# EAGLE design USB_Serial_Bridge (EAGLE 9.1.1)

## Sheet 1 of 2
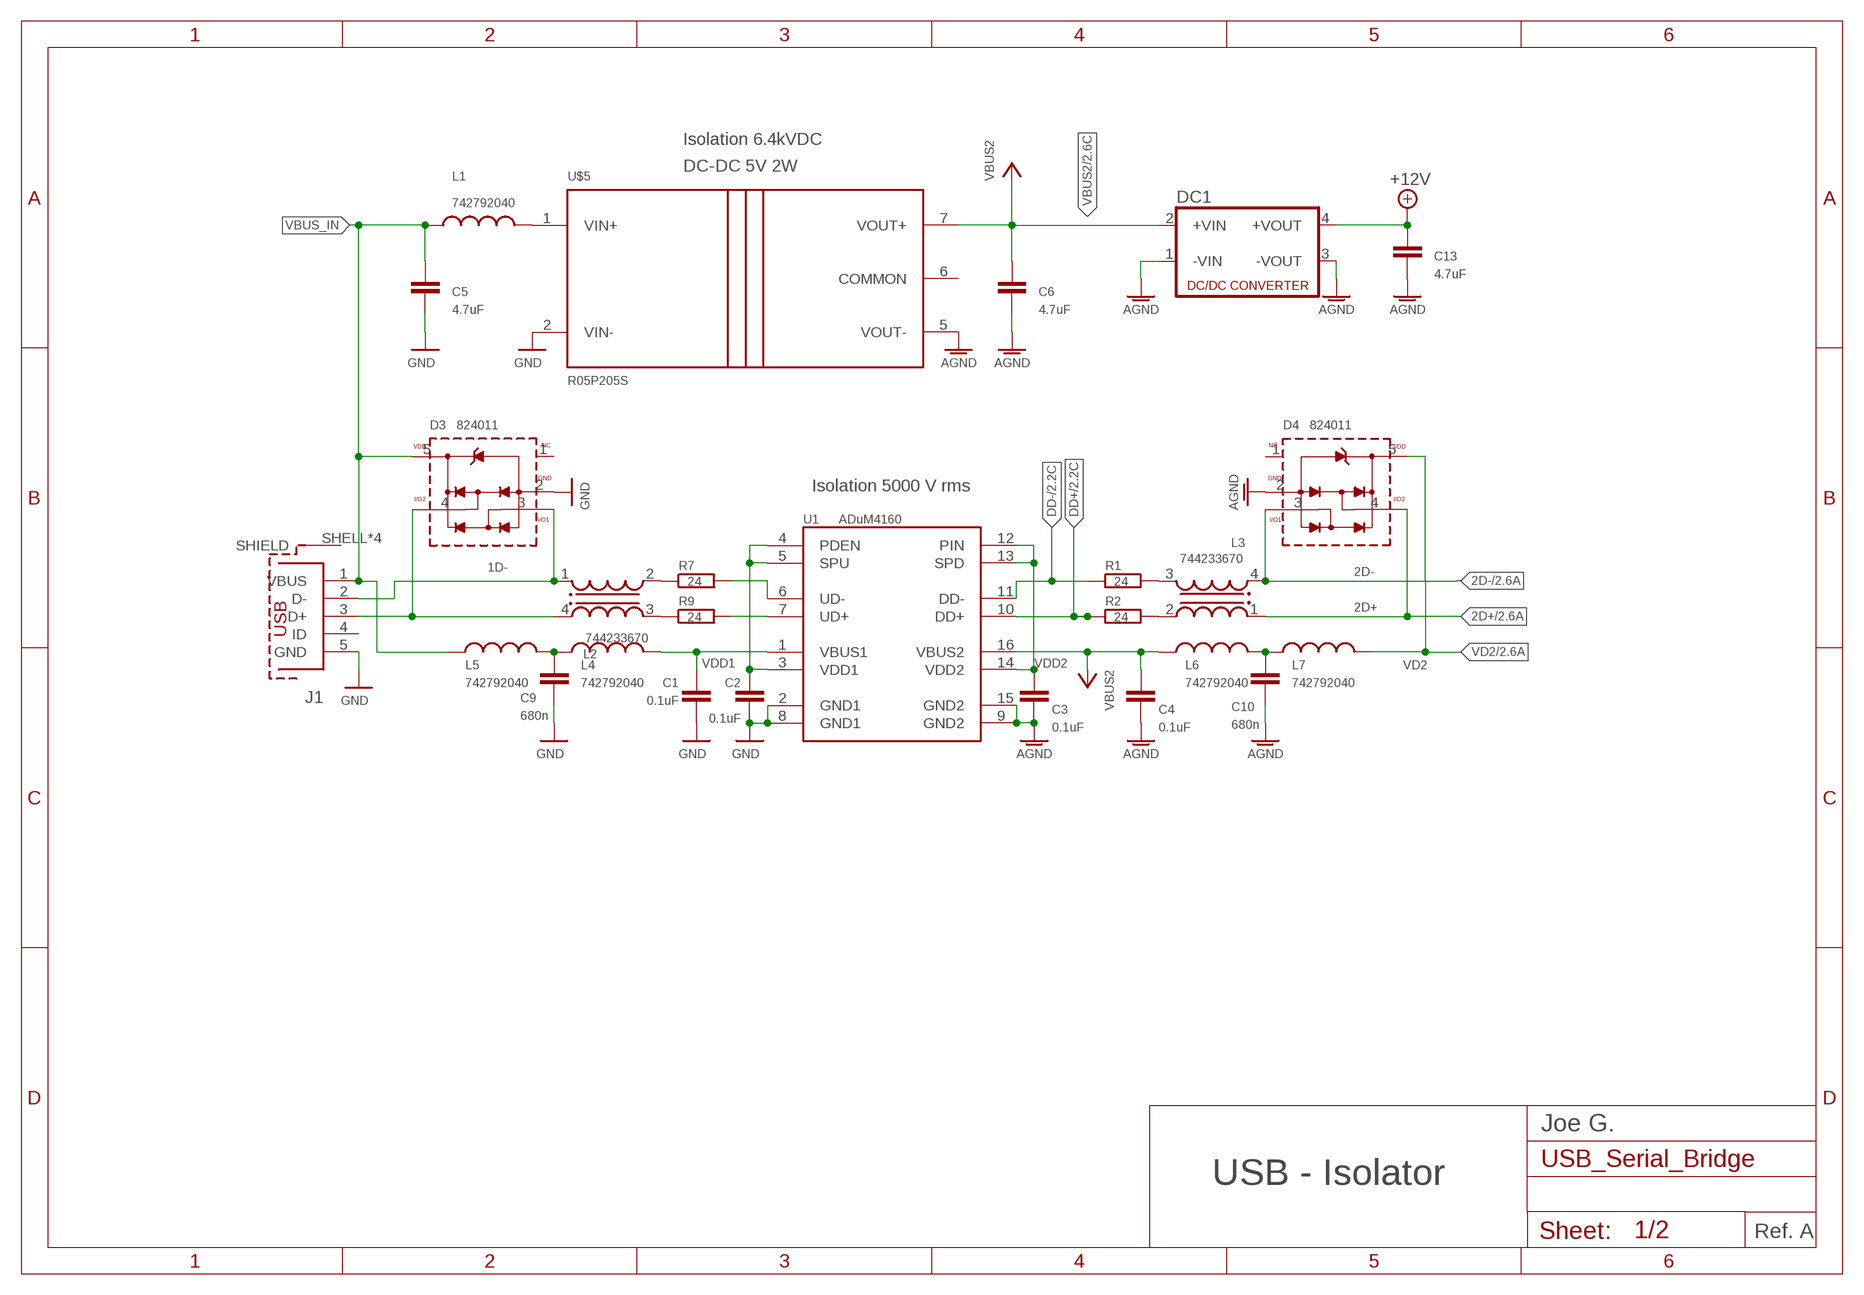
[diagram p0: schematic, sheet 1]

### Parts
C1  0.1uF  CAP0805  [0805]
C2  0.1uF  CAP0805  [0805]
C3  0.1uF  CAP0805  [0805]
C4  0.1uF  CAP0805  [0805]
C5  4.7uF  CAP1206  [1206]
C6  4.7uF  CAP1206  [1206]
C9  680n  C-EUC0805K  [C0805K]
C10  680n  C-EUC0805  [C0805]
C13  4.7uF  CAP1206  [1206]
D3  824011  WE-TVS_824011  [WE-TVS_SOT23-5L]
D4  824011  WE-TVS_824011  [WE-TVS_SOT23-5L]
DC1  DC-DC-CONVERTER_NME  [DC-DC-CONVERTER_NME]
J1  651305142821  [651305142821]
L1  742792040  WE-CBF_0805_74279204_WB_HS  [WE-CBF_0805(W=3.0)]
L2  744233670  WE-CNSW_0805_744231061  [WE-CNSW_0805]
L3  744233670  WE-CNSW_0805_744231061  [WE-CNSW_0805]
L4  742792040  WE-CBF_0805_74279204_WB_HS  [WE-CBF_0805(W=3.0)]
L5  742792040  WE-CBF_0805_74279204_WB_HS  [WE-CBF_0805(W=3.0)]
L6  742792040  WE-CBF_0805_74279204_WB_HS  [WE-CBF_0805(W=3.0)]
L7  742792040  WE-CBF_0805_74279204_WB_HS  [WE-CBF_0805(W=3.0)]
R1  24  R-EU_R0805  [R0805]
R2  24  R-EU_R0805  [R0805]
R7  24  R-EU_R0805  [R0805]
R9  24  R-EU_R0805  [R0805]
U1  ADuM4160  ADUM4160  [SO16W]
U$5  R05P205S  [SIP7_RECON]

### Nets
1D+: D3.4(I/O2) J1.3(D+) L2.4
1D-: D3.3(I/O1) J1.2(D-) L2.1
2D+: D4.4(I/O2) L3.1 ; also sheet 2
2D-: D4.3(I/O1) L3.4 ; also sheet 2
+12V: C13.1 DC1.4(+VOUT) ; also sheet 2
AGND: C3.2 C4.2 C6.2 C10.2 C13.2 D4.2(GND) DC1.1(-VIN) DC1.3(-VOUT) U1.9(GND2) U1.15(GND2) U$5.5(VOUT-) ; also sheet 2
DD+: R2.1 U1.10(DD+) ; also sheet 2
DD-: R1.1 U1.11(DD-) ; also sheet 2
GND: C1.2 C2.2 C5.2 C9.2 D3.2(GND) J1.5(GND) U1.2(GND1) U1.8(GND1) U$5.2(VIN-)
N$2: L2.2 R7.1
N$3: L3.3 R1.2
N$4: L3.2 R2.2
N$5: R9.2 U1.7(UD+)
N$6: L2.3 R9.1
N$7: R7.2 U1.6(UD-)
N$8: C9.1 L4.1 L5.2
N$10: L1.2 U$5.1(VIN+)
N$14: C10.1 L6.2 L7.1
VBUS1: C1.1 L4.2 U1.1(VBUS1)
VBUS2: C4.1 C6.1 DC1.2(+VIN) L6.1 U1.16(VBUS2) U$5.7(VOUT+) ; also sheet 2
VBUS_IN: C5.1 D3.5(VDD) J1.1(VBUS) L1.1 L5.1
VD2: D4.5(VDD) L7.2 ; also sheet 2
VDD1: C2.1 U1.3(VDD1) U1.4(PDEN) U1.5(SPU)
VDD2: C3.1 U1.12(PIN) U1.13(SPD) U1.14(VDD2)
Unconnected: D3.1(NC) D4.1(NC) J1.4(ID) J1.SHELL1(SHIELD) J1.SHELL2(SHIELD) J1.SHELL3(SHIELD) J1.SHELL(SHIELD)

### Notes on the sheet
- Isolation 6.4kVDC
- DC-DC 5V 2W
- Isolation 5000 V rms
- Joe G.
- USB - Isolator
- Ref. A

## Sheet 2 of 2
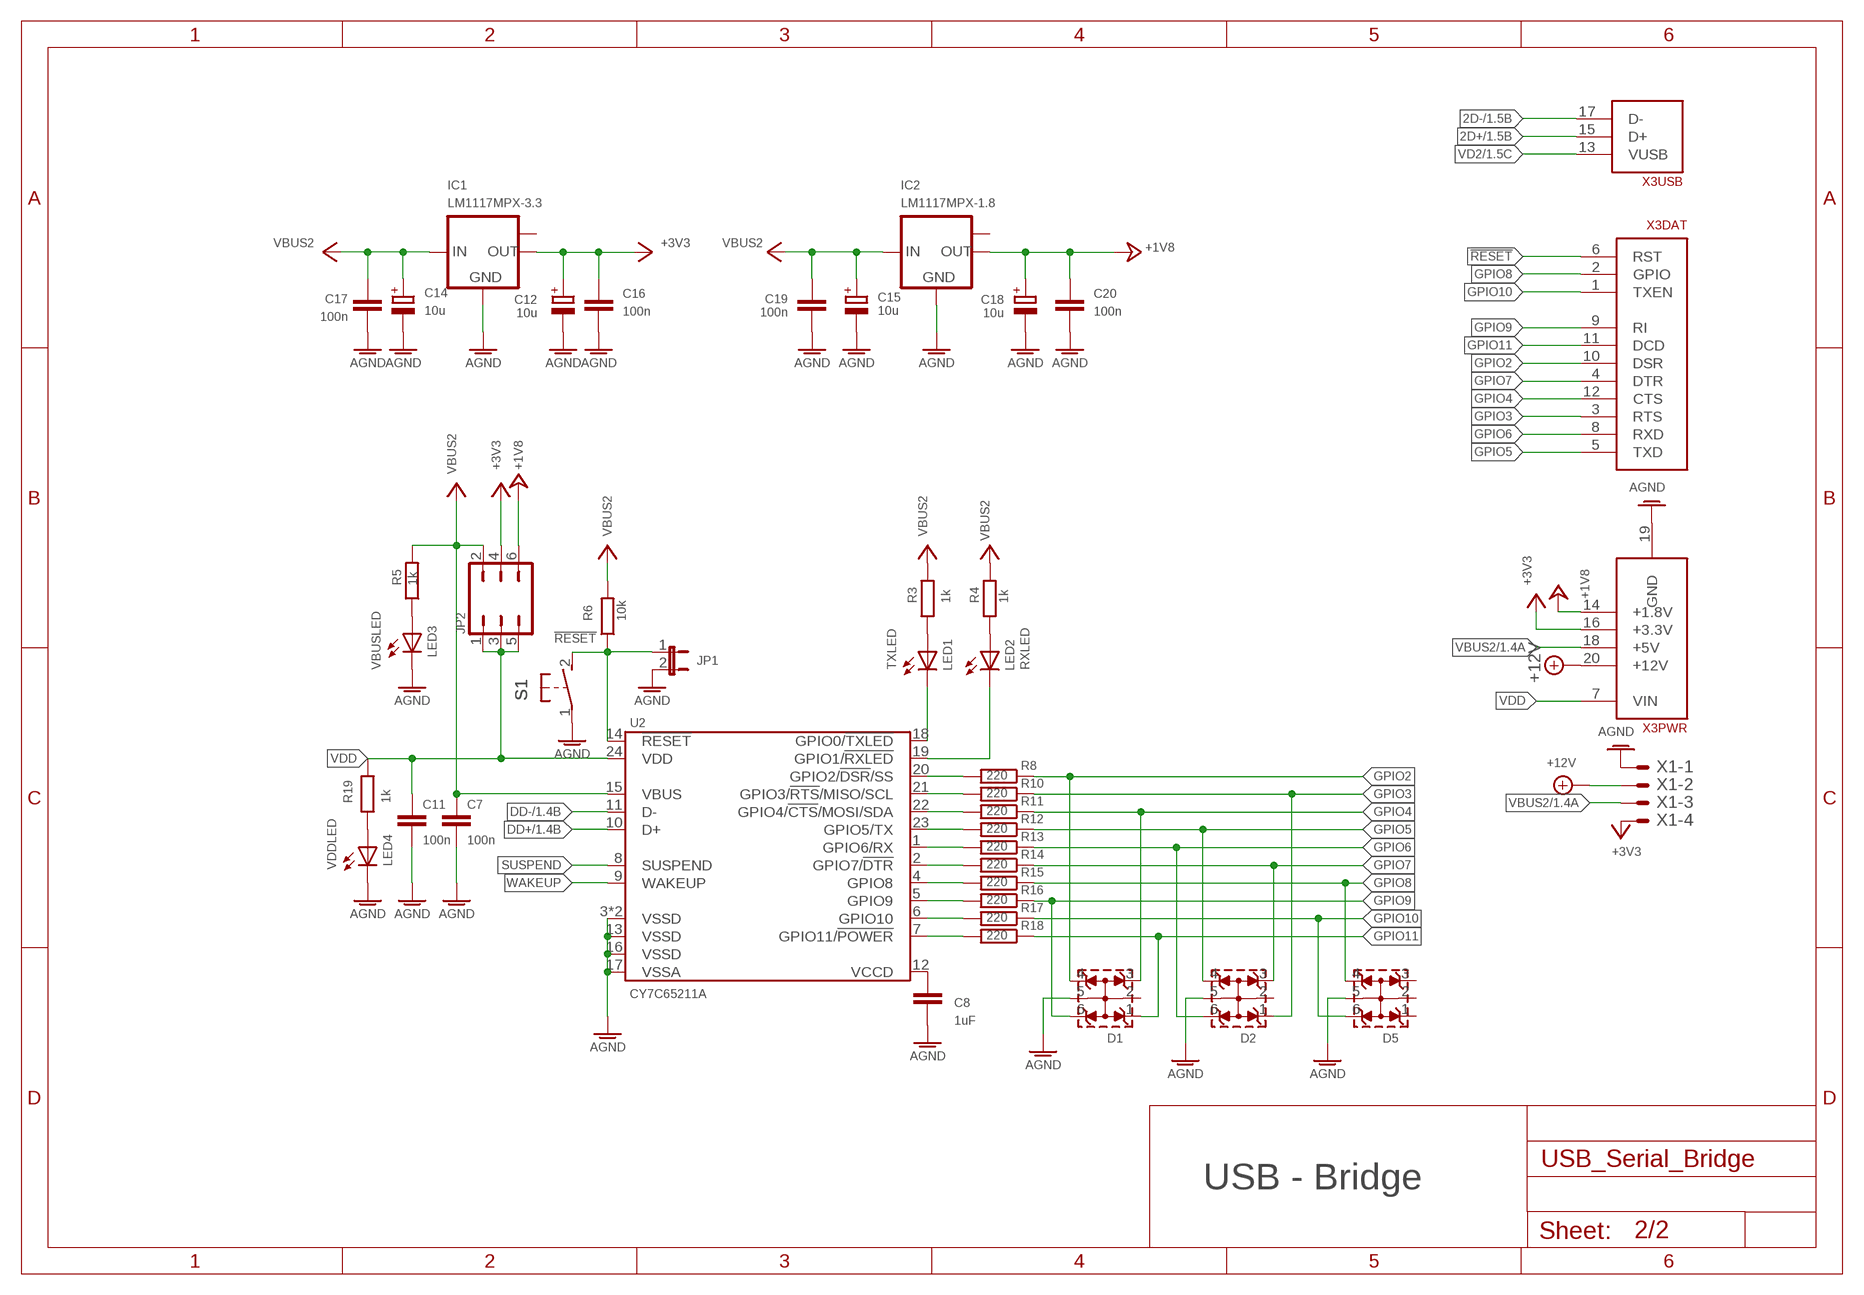
[diagram p1: schematic, sheet 2]

### Parts
C7  100n  C-EUC0805  [C0805]
C8  1uF  CAP1206  [1206]
C11  100n  C-EUC0805  [C0805]
C12  10u  CPOL-EUSMCB  [SMC_B]
C14  10u  CPOL-EUSMCB  [SMC_B]
C15  10u  CPOL-EUSMCB  [SMC_B]
C16  100n  C-EUC0805  [C0805]
C17  100n  C-EUC0805  [C0805]
C18  10u  CPOL-EUSMCB  [SMC_B]
C19  100n  C-EUC0805  [C0805]
C20  100n  C-EUC0805  [C0805]
D1  WE-TVS_82402304  [WE-TVS_SOT23-6L]
D2  WE-TVS_82402304  [WE-TVS_SOT23-6L]
D5  WE-TVS_82402304  [WE-TVS_SOT23-6L]
IC1  LM1117MPX-3.3  LM1117MPX-1.8  [SOT223]
IC2  LM1117MPX-1.8  LM1117MPX-3.3  [SOT223]
JP1  JP1E  [JP1]
JP2  JP3Q  [JP3Q]
LED1  LEDSML0603  [SML0603]
LED2  LEDSML0603  [SML0603]
LED3  LEDSML0603  [SML0603]
LED4  LEDSML0603  [SML0603]
R3  1k  R-EU_M0805  [M0805]
R4  1k  R-EU_M0805  [M0805]
R5  1k  R-EU_M0805  [M0805]
R6  10k  R-EU_M0805  [M0805]
R8  220  R-EU_M0805  [M0805]
R10  220  R-EU_M0805  [M0805]
R11  220  R-EU_M0805  [M0805]
R12  220  R-EU_M0805  [M0805]
R13  220  R-EU_M0805  [M0805]
R14  220  R-EU_M0805  [M0805]
R15  220  R-EU_M0805  [M0805]
R16  220  R-EU_M0805  [M0805]
R17  220  R-EU_M0805  [M0805]
R18  220  R-EU_M0805  [M0805]
R19  1k  R-EU_M0805  [M0805]
S1  SWITCH-OMRON_31-XX  [SWITCH-OMRON_B3F-31XX]
U2  CY7C65211A  CY7C65211  [QFN-24]
X1  AKL18X-04W  [AKL182-04]
X3  ALLSERIALMM  [MAIN-THT]

### Nets
2D+: X3.15(USB:D+) ; also sheet 1
2D-: X3.17(USB:D-) ; also sheet 1
!RESET: JP1.1 R6.1 S1.2(S) U2.14(!RESET) X3.6(DAT:RST)
+1V8: C18.+ C20.1 IC2.2(OUT) JP2.6 X3.14(PWR:+1.8V)
+3V3: C12.+ C16.1 IC1.2(OUT) JP2.4 X1.P$4 X3.16(PWR:+3.3V)
+12V: X1.P$2 X3.20(PWR:+12V) ; also sheet 1
AGND: C7.2 C8.2 C11.2 C12.- C14.- C15.- C16.2 C17.2 C18.- C19.2 C20.2 D1.5(GND) D2.5(GND) D5.5(GND) IC1.1(GND) IC2.1(GND) JP1.2 LED3.C LED4.C S1.1(P) U2.3(VSSD) U2.13(VSSD) U2.16(VSSD) U2.17(VSSA) U2.EP(VSSD) X1.P$1 X3.19(PWR:GND) ; also sheet 1
DD+: U2.10(D+) ; also sheet 1
DD-: U2.11(D-) ; also sheet 1
GPIO2: D1.4 R8.1 X3.10(DAT:DSR)
GPIO3: D2.1 R10.1 X3.3(DAT:RTS)
GPIO4: D1.3 R11.1 X3.12(DAT:CTS)
GPIO5: D2.4 R12.1 X3.5(DAT:TXD)
GPIO6: D2.6 R13.1 X3.8(DAT:RXD)
GPIO7: D2.3 R14.1 X3.4(DAT:DTR)
GPIO8: D5.4 R15.1 X3.2(DAT:GPIO)
GPIO9: D1.6 R16.1 X3.9(DAT:RI)
GPIO10: D5.6 R17.1 X3.1(DAT:TXEN)
GPIO11: D1.1 R18.1 X3.11(DAT:DCD)
N$11: C8.1 U2.12(VCCD)
N$15: LED4.A R19.1
N$18: LED1.A R3.1
N$19: LED2.A R4.1
N$21: LED1.C U2.18(GPIO0/!TXLED)
N$22: LED2.C U2.19(GPIO1/!RXLED)
N$23: R8.2 U2.20(GPIO2/!DSR!/SS)
N$24: R10.2 U2.21(GPIO3/!RTS!/MISO/SCL)
N$25: LED3.A R5.1
N$26: R11.2 U2.22(GPIO4/!CTS!/MOSI/SDA)
N$27: R12.2 U2.23(GPIO5/TX)
N$28: R13.2 U2.1(GPIO6/RX)
N$29: R14.2 U2.2(GPIO7/!DTR)
N$30: R15.2 U2.4(GPIO8)
N$31: R16.2 U2.5(GPIO9)
N$32: R17.2 U2.6(GPIO10)
N$33: R18.2 U2.7(GPIO11/!POWER)
SUSPEND: U2.8(SUSPEND)
VBUS2: C7.1 C14.+ C15.+ C17.1 C19.1 IC1.3(IN) IC2.3(IN) JP2.2 R3.2 R4.2 R5.2 R6.2 U2.15(VBUS) X1.P$3 X3.18(PWR:+5V) ; also sheet 1
VD2: X3.13(USB:VUSB) ; also sheet 1
VDD: C11.1 JP2.1 JP2.3 JP2.5 R19.2 U2.24(VDD) X3.7(PWR:VIN)
WAKEUP: U2.9(WAKEUP)
Unconnected: D1.2(GND) D2.2(GND) D5.1 D5.2(GND) D5.3 IC1.TAB(OUT1) IC2.TAB(OUT1)

### Notes on the sheet
- VBUSLED | TXLED | RXLED
- VDDLED
- USB - Bridge

## Power pins joined to a net without a drawn wire
COMMON: U$5.6(COMMON)

## Library data of the parts
C1-C6 C8 C13 = CH_passive:CAP: Capacitor Standard 0603 ceramic capacitor, and 0.1" leaded capacitor.
C7 C9-C11 C16 C17 C19 C20 = rcl:C-EU: CAPACITOR, European symbol
C12 C14 C15 C18 = rcl:CPOL-EU: POLARIZED CAPACITOR, European symbol
D1 D2 D5 = EMCComponents (rev18c):WE-TVS_82402304: TVS Diode Standard Series Characteristics Operating temperature: –55 ºC to +85 °C for 824 023 x; –55 ºC to +125 °C for 824 021/824 022 Very low clamping voltage High ESD withstand voltage Unidirectional or bidirectional protection RoHS, REACH and free of halogens Applications DC power supply Headsets and accessories PDAs Digital cameras MP3-Player Touch Panels ESD protection in accordance with EN 61000-4-2 – 8 kV contact discharge – 15 kV air discharge Updated by Dan Xu 2014-07-11 2014 (C) Wurth Elektronik
D3 D4 = EMCComponents (rev18c):WE-TVS_824011: TVS Diode High Speed Series Characteristics Low clamping voltage Sturdy design Very low capacitance Flow Thru Design for a simple layout Rail to Rail protection Epoxy flame resistant UL94 V-0 RoHS, REACH and free of halogens Applications Very fast data lines USB 2.0 Ethernet PoE VGA Sim Cards Keypads ESD protection in accordance with EN 61000-4-2, – 8 kV contact discharge – 15 kV air discharge <http://katalog.we-online.de/media/images/v2/Family_WE-TVS_HIGHSPEED.jpg> Details see: http://katalog.we-online.de/en/pbs/WE-TVS_High_Speed/824001? Updated by Dan Xu 2014-07-11 2014 (C) Wurth Elektronik
DC1 = OUT_dc-dc-converter:DC-DC-CONVERTER_NME: DC-DC CONVERTER; MF: C & D TECHNOLOGIES, INC; MPN: NME1205D; OC_FARNELL: 1021466; OC_NEWARK: 98B8198
IC1 IC2 = lm1117:LM1117MPX-*
J1 = InputOutputIO (rev18a):651305142821: WR-COM Horizontal 5 Contacts Mini USB Type AB=>Code : Con_I-O_COM_MiniUSB_651305142821 <http://katalog.we-online.de/media/images/eican/Con_I-O_COM_MiniUSB_651305142821_pf2.jpg> Details see: http://katalog.we-online.de/en/em/COM_SMT_MINI_TYPE_AB_HORIZONTAL/651305142821 Created 2014-07-09, Karrer Zheng 2014 (C) Würth Elektronik
JP1 = jumper:JP1E: JUMPER
JP2 = jumper:JP3Q: JUMPER
L1 L4-L7 = EMCComponents (rev18c):WE-CBF_0805: WE-CBF SMD EMI Suppression Ferrite Bead Characteristics Reliable Ni-Sn electrodes High rated current up to 6 A Operating temperature: –55 ºC to +125 ºC Applications Perfect as data lined filter and for uncoupling of distribution voltage Variant abbreviation WB means WIDE BAND HS means HIGH SPEED HC means HIGH CURRENT <http://katalog.we-online.de/media/images/v2/Family_WE-CBF.jpg> Details see: http://katalog.we-online.de/en/pbs/WE-CBF Updated on 2014-06-19 2014 (C) Wurth Elektronik; WE-NUMBER: 74279204/600Ω(Z@100MHz)
L2 L3 = EMCComponents (rev18c):WE-CNSW_0805: WE-CNSW SMD Common Mode Line Filter Characteristics High common mode noise suppression at high frequencies Small influence on high speed signals through winding symmetry Operating temperature: –40 ºC to +125 ºC (Size 0805/1206/1812); –40 ºC to +105 ºC (Size 0603) Applications USB 2.0 IEEE 1394 (Firewire) LVDS High Speed Data Lines LAN <http://katalog.we-online.de/media/images/v2/we-cnsw_stroko_smd_gruppe.jpg> Details see: http://katalog.we-online.de/en/pbs/WE-CNSW Updated by Dan Xu 2014-06-30 2014 (C) Wurth Elektronik; WE-NUMBER: 744231061/67Ω(Z@100MHz)
LED1-LED4 = led:LED: LED OSRAM: - CHIPLED LG R971, LG N971, LY N971, LG Q971, LY Q971, LO R971, LY R971 LH N974, LH R974 LS Q976, LO Q976, LY Q976 LO Q996 - Hyper CHIPLED LW Q18S LB Q993, LB Q99A, LB R99A - SideLED LS A670, LO A670, LY A670, LG A670, LP A670 LB A673, LV A673, LT A673, LW A673 LH A674 LY A675 LS A676, LA A676, LO A676, LY A676, LW A676 LS A679, LY A679, LG A679 - Hyper Micro SIDELED® LS Y876, LA Y876, LO Y876, LY Y876 LT Y87S - SmartLED LW L88C, LW L88S LB L89C, LB L89S, LG L890 LS L89K, LO L89K, LY L89K LS L896, LA L896, LO L896, LY L896 - TOPLED LS T670, LO T670, LY T670, LG T670, LP T670 LSG T670, LSP T670, LSY T670, LOP T670, LYG T670 LG T671, LOG T671, LSG T671 LB T673, LV T673, LT T673, LW T673 LH T674 LS T676, LA T676, LO T676, LY T676, LB T676, LH T676, LSB T676, LW T676 LB T67C, LV T67C, LT T67C, LS T67K, LO T67K, LY T67K, LW E67C LS E67B, LA E67B, LO E67B, LY E67B, LB E67C, LV E67C, LT E67C LW T67C LS T679, LY T679, LG T679 LS T770, LO T770, LY T770, LG T770, LP T770 LB T773, LV T773, LT T773, LW T773 LH T774 LS E675, LA E675, LY E675, LS T675 LS T776, LA T776, LO T776, LY T776, LB T776 LHGB T686 LT T68C, LB T68C - Hyper Mini TOPLED® LB M676 - Mini TOPLED Santana® LG M470 LS M47K, LO M47K, LY M47K Source: http://www.osram.convergy.de LUXEON: - LUMILED® LXK2-PW12-R00, LXK2-PW12-S00, LXK2-PW14-U00, LXK2-PW14-V00 LXK2-PM12-R00, LXK2-PM12-S00, LXK2-PM14-U00 LXK2-PE12-Q00, LXK2-PE12-R00, LXK2-PE12-S00, LXK2-PE14-T00, LXK2-PE14-U00 LXK2-PB12-K00, LXK2-PB12-L00, LXK2-PB12-M00, LXK2-PB14-N00, LXK2-PB14-P00, LXK2-PB14-Q00 LXK2-PR12-L00, LXK2-PR12-M00, LXK2-PR14-Q00, LXK2-PR14-R00 LXK2-PD12-Q00, LXK2-PD12-R00, LXK2-PD12-S00 LXK2-PH12-R00, LXK2-PH12-S00 LXK2-PL12-P00, LXK2-PL12-Q00, LXK2-PL12-R00 Source: www.luxeon.com KINGBRIGHT: KA-3528ASYC Source: www.kingbright.com
R1-R19 = rcl:R-EU_: RESISTOR, European symbol
S1 = switch_omron_1:SWITCH-OMRON_31-XX: OMRON SWITCH; MPN: B3F-3100; OC_FARNELL: 959704; OC_NEWARK: 36M3582
U1 = CH_Analog_Devices:ADUM4160: Analog Devices Low/Full Speed USB Isolator
U2 = Cypress:CY7C65211
U$5 = traco_tma:R05P205S
X1 = Testcon-riacon_akl:AKL18X-04: Riacon AKL18X Steckverbinder 4-Pol Grid = 3,5mm
X3 = AllSerial:ALLSERIAL

## Board
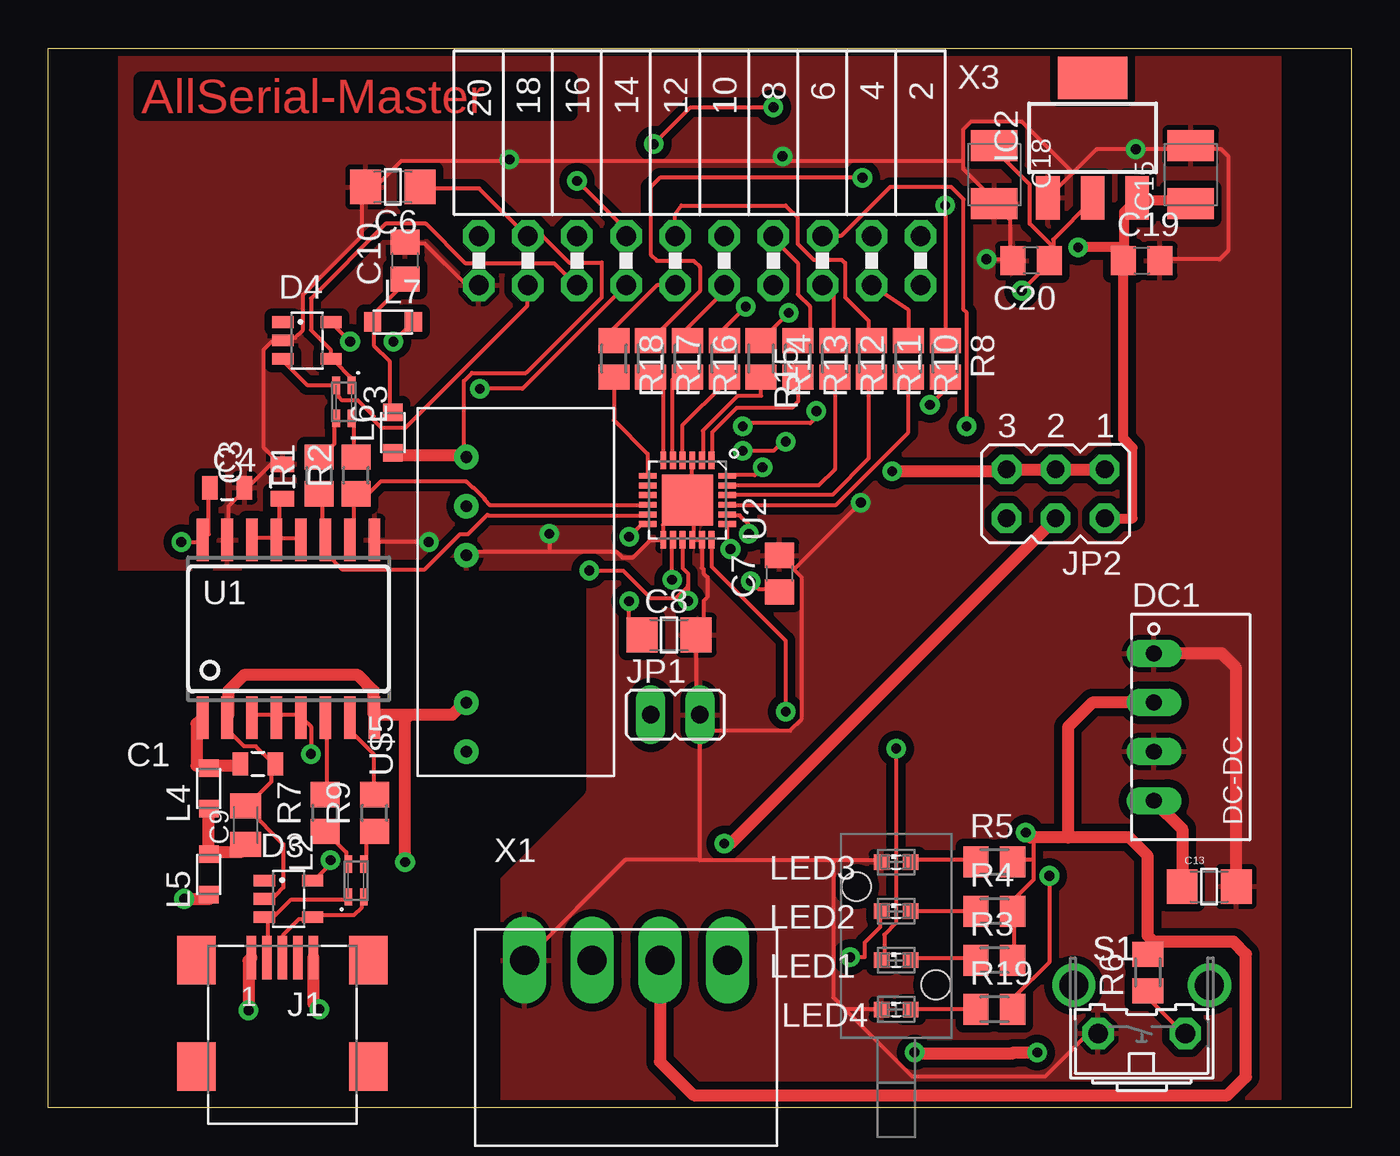
[diagram p2: board, top side]
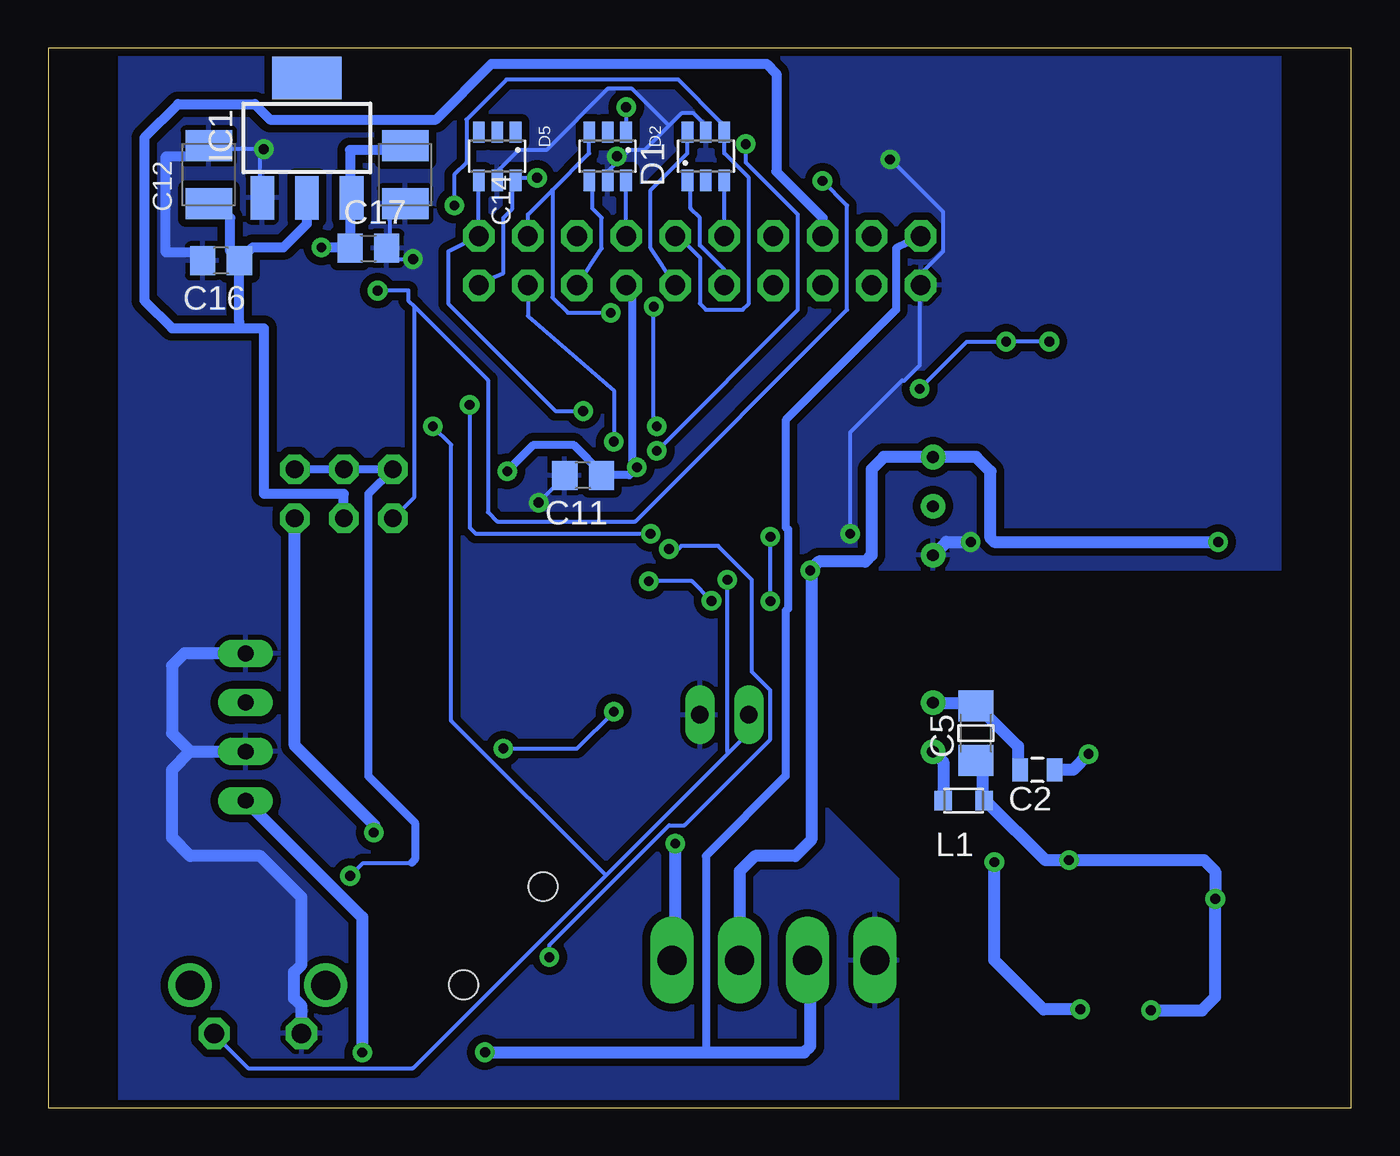
[diagram p3: board, bottom side, seen from below]

Size 67.4 x 54.8 mm. Coordinates in mm from the lower left corner, seen from the top.
Copper layers (1*16): Top 0.035mm / dielectric 1.5mm / Bottom 0.035mm
Design rules "CHome": minimum track width 8mil, minimum drill 20mil, track to track 8mil, track to pad 8mil, pad to pad 8mil, via to via 8mil, smd to smd 8mil, copper to edge 10mil, drill to drill 8mil, minimum pad ring 12mil, minimum via ring 10mil, stop-mask expansion 4mil, vias tented up to drill 25mil, thermal gap 10mil
tRestrict: area 3.2,0 to 27.4,27.3
bRestrict: area 3.2,0 to 27.4,27.3

### Footprints (pad centres in the part's own frame; a part is rotated, then mirrored left to right if it is on the bottom)
0805 = smd 0.8 x 1.2: 1 -0.9,0; 2 0.9,0
1206 = smd 1.6 x 1.8: 1 -1.4,0; 2 1.4,0
C0805 = smd 1.3 x 1.5: 1 -0.95,0; 2 0.95,0
C0805K = smd 1.3 x 1.6: 1 -1,0; 2 1,0
SMC_B = smd 1.6 x 2.4: + -1.5,0; - 1.5,0
WE-TVS_SOT23-6L = smd 1.1 x 0.6: 1 -1.25,0.95; 2 -1.25,0; 3 -1.25,-0.95; 4 1.25,-0.95; 5 1.25,0; 6 1.25,0.95
WE-TVS_SOT23-5L = smd 1.1 x 0.6: 1 -1.25,0.95; 2 -1.25,0; 3 -1.25,-0.95; 4 1.25,-0.95; 5 1.25,0.95
DC-DC-CONVERTER_NME = drill 0.813 long: 1 0,3.81; 2 0,1.27; 3 0,-1.27; 4 0,-3.81
SOT223 = smd 1.219 x 2.235: 1 -2.311,-3.099; 2 0,-3.099; 3 2.311,-3.099 | smd 3.6 x 2.2: TAB 0,3.099
651305142821 = smd 0.5 x 2.25: 1 -1.6,0.125; 2 -0.8,0.125; 3 0,0.125; 4 0.8,0.125; 5 1.6,0.125 | smd 2 x 2.5: SHELL -4.45,0; SHELL1 4.45,0; SHELL2 4.45,-5.5; SHELL3 -4.45,-5.5
JP1 = drill 0.914 long: 1 0,-1.27; 2 0,1.27
JP3Q = drill 0.914 octagon: 1 -2.54,-1.27; 2 -2.54,1.27; 3 0,-1.27; 4 0,1.27; 5 2.54,-1.27; 6 2.54,1.27
WE-CBF_0805(W=3.0) = smd 0.9 x 1: 1 -1.05,0; 2 1.05,0
WE-CNSW_0805 = smd 0.9 x 0.4: 1 -0.85,0.4; 2 0.85,0.4; 3 0.85,-0.4; 4 -0.85,-0.4
SML0603 = smd 0.8 x 0.8: A 0.75,0; C -0.75,0
R0805 = smd 1.3 x 1.5: 1 -0.95,0; 2 0.95,0
M0805 = smd 1.3 x 1.6: 1 -0.95,0; 2 0.95,0
SWITCH-OMRON_B3F-31XX = drill 1.016 octagon: 1 -2.261,-1.245; 2 2.261,-1.245 | drill 1.499 pad 2.159: 3 -3.505,1.245; 4 3.505,1.245
SO16W = smd 0.6 x 2.2: 1 -4.445,-4.6; 2 -3.175,-4.6; 3 -1.905,-4.6; 4 -0.635,-4.6; 5 0.635,-4.6; 6 1.905,-4.6; 7 3.175,-4.6; 8 4.445,-4.6; 9 4.445,4.6; 10 3.175,4.6; 11 1.905,4.6; 12 0.635,4.6; 13 -0.635,4.6; 14 -1.905,4.6; 15 -3.175,4.6; 16 -4.445,4.6
QFN-24 = smd 0.9 x 0.3: 1 -2.05,1.25; 2 -2.05,0.75; 3 -2.05,0.25; 4 -2.05,-0.25; 5 -2.05,-0.75; 6 -2.05,-1.25; 13 2.05,-1.25; 14 2.05,-0.75; 15 2.05,-0.25; 16 2.05,0.25; 17 2.05,0.75; 18 2.05,1.25 | smd 0.3 x 0.9: 7 -1.25,-2.05; 8 -0.75,-2.05; 9 -0.25,-2.05; 10 0.25,-2.05; 11 0.75,-2.05; 12 1.25,-2.05; 19 1.25,2.05; 20 0.75,2.05; 21 0.25,2.05; 22 -0.25,2.05; 23 -0.75,2.05; 24 -1.25,2.05 | smd 2.65 x 2.65: EP 0,0
1296.1004 = hole 1.5: 2.05,-2.54; -2.05,2.54
SIP7_RECON = drill 0.6 pad 1.27: 1 -8.89,3.81; 2 -6.35,3.81; 5 1.27,3.81; 6 3.81,3.81; 7 6.35,3.81
AKL182-04 = drill 1.5 pad 2.184 long: P$1 -5.25,0; P$2 -1.75,0; P$3 1.75,0; P$4 5.25,0
MAIN-THT = drill 1.016 octagon: 1 11.43,42.545; 2 11.43,45.085; 3 8.89,42.545; 4 8.89,45.085; 5 6.35,42.545; 6 6.35,45.085; 7 3.81,42.545; 8 3.81,45.085; 9 1.27,42.545; 10 1.27,45.085; 11 -1.27,42.545; 12 -1.27,45.085; 13 -3.81,42.545; 14 -3.81,45.085; 15 -6.35,42.545; 16 -6.35,45.085; 17 -8.89,42.545; 18 -8.89,45.085; 19 -11.43,42.545; 20 -11.43,45.085

### Placement (x,y rotation side)
C1  10.84,17.78 0 top
C2  16.24,17.46 180 bottom
C3  12.11,32.38 90 top
C4  9.25,32.07 0 top
C5  19.41,19.37 90 bottom
C6  17.83,47.62 180 top
C7  37.83,27.62 90 top
C8  32.11,24.45 0 top
C9  10.21,14.61 90 top
C10  18.46,43.81 90 top
C11  39.73,32.7 180 bottom
C12  59.1,48.26 90 bottom
C13  60.05,11.43 0 top
C14  48.94,48.26 270 bottom
C15  59.1,48.26 90 top
C16  58.47,43.81 180 bottom
C17  50.84,44.45 0 bottom
C18  48.94,48.26 270 top
C19  56.56,43.81 0 top
C20  50.84,43.81 180 top
D1  33.38,49.21 90 bottom
D2  38.46,49.21 270 bottom
D3  12.43,10.79 0 top
D4  13.38,39.69 0 top
D5  44.18,49.21 270 bottom
DC1  57.2,19.68 0 top
IC1  54.02,50.16 0 bottom
IC2  54.02,50.16 0 top
J1  12.11,7.62 0 top
JP1  32.43,20.32 270 top
JP2  52.12,31.75 180 top
L1  20.05,15.88 180 bottom
L2  15.92,11.75 90 top
L3  15.29,36.51 270 top
L4  8.3,16.51 90 top
L5  8.3,12.06 90 top
L6  17.83,34.92 90 top
L7  17.83,40.64 0 top
LED1  43.86,7.62 0 top
LED2  43.86,10.16 0 top
LED3  43.86,12.7 0 top
LED4  43.86,5.08 0 top
R1  14.02,32.7 90 top
R2  15.92,32.7 90 top
R3  48.94,7.62 0 top
R4  48.94,10.16 0 top
R5  48.94,12.7 0 top
R6  56.88,6.99 90 top
R7  14.33,15.24 90 top
R8  46.4,38.73 270 top
R9  16.87,15.24 90 top
R10  44.5,38.73 270 top
R11  42.59,38.73 270 top
R12  40.69,38.73 270 top
R13  38.78,38.73 270 top
R14  36.88,38.73 270 top
R15  34.97,38.73 270 top
R16  33.07,38.73 270 top
R17  31.16,38.73 270 top
R18  29.26,38.73 270 top
R19  48.94,5.08 0 top
S1  56.56,5.08 0 top
U1  12.43,24.77 0 top
U2  33.07,31.43 270 top
U$1  [1296.1004]  43.86,8.89 180 top
U$5  25.45,27.3 90 top
X1  29.89,7.62 0 top
X3  33.7,0 0 top

### Tracks (layer width: path | path; a pad name or v marks a point on that pad's centre or on a via)
1D+
  Top 0.203: L2.4 16.23,10.77 16.23,10.36 15.82,9.96 13.79,9.96 D3.4 13.58,9.75 12.97,9.75 12.16,8.94 12.16,7.92 J1.3
1D-
  Top 0.203: L2.1 15.41,10.77 12.57,10.77 11.75,9.96 11.35,9.96 D3.3 11.35,9.75 11.35,7.92 J1.2
2D+
  Top 0.203: L3.1 15.62,37.39 15.62,37.8 14.8,38.61 D4.4 14.6,38.81 14.6,39.22 13.58,40.23 13.58,41.86 17.44,45.72 19.54,45.72 21.6,43.66 26.18,43.66 27.3,42.55 X3.15
2D-
  Top 0.203: D4.3 12.16,38.61 13.38,37.39 14.8,37.39 L3.4 15.01,37.19 15.01,36.78 15.21,36.58 16.02,36.58 16.83,35.76 16.83,35.56 17.24,35.15 18.46,35.15 24.76,41.45 24.76,42.44 24.81,42.45 X3.17
!RESET  (via drill 0.51)
  Top 0.203: R6.1 57.07,5.98 57.07,5.49 58.69,3.86 S1.2 | v32.27,27.3 32.27,29.37 U2.14 | v47.51,35.24 47.51,41.12 47.35,41.27 47.35,46.99 46.72,47.62 43.54,47.62 41,45.09 X3.6
  Bottom 0.203: S1.2 58.69,3.66 57.07,2.03 48.53,2.03 38.56,12.01 | 38.56,12.01 32.21,18.36 | 32.21,18.36 31.26,19.3 31.26,20.32 JP1.1 | v32.27,27.3 32.27,18.41 32.21,18.36 | 38.56,12.01 46.56,20 46.56,34.29 v47.51,35.24
+1V8  (via drill 0.51)
  Top 0.203: 51.99,44.5 51.99,44.91 54.02,46.94 IC2.2 | 51.99,44.5 51.99,43.89 C20.1 | 51.99,44.5 50.77,45.72 50.77,47.75 48.94,49.58 C18.+ | 51.99,44.5 C20.1 | X3.14 29.57,45.72 v27.35,47.94 | v50.36,42.27 51.79,43.69 C20.1
  Bottom 0.203: v27.35,47.94 26.08,46.67 26.08,41.27 37.03,30.32 44.18,30.32 44.65,30.8 44.65,37.62 48.46,41.43 | v50.36,42.27 48.78,42.27 48.78,41.75 48.46,41.43 | JP2.6 48.46,31.59 48.46,41.43
+3V3  (via drill 0.51)
  Top 0.61: v34.97,13.65 35.29,13.65 JP2.4
  Bottom 0.203: 54.02,46.62 IC1.2 | 34.97,7.79 X1.P$4
  Bottom 0.508: JP2.4 52.12,31.75 56.24,31.75 56.24,40.32 57.51,40.32 | X3.16 27.35,46.04 29.73,48.42 29.73,53.5 30.23,53.99 44.48,53.99 47.35,51.12 55.93,51.12 56.72,51.91 60.69,51.91 62.43,50.16 62.43,41.75 61.01,40.32 57.51,40.32 | 57.51,40.32 57.51,40.64 57.52,40.64 C16.1 | 54.02,46.62 54.02,45.72 55.23,44.51 56.82,44.51 C16.1 | C12.+ 58.73,46.76 57.99,46.02 57.99,44.29 C16.1
  Bottom 0.61: v34.97,13.65 34.97,7.79
+12V  (via drill 0.51)
  Top 0.61: DC1.4 58.65,14.42 C13.1 | v51.16,2.85 49.93,2.85 49.87,2.78 44.89,2.78 v44.81,2.86
  Bottom 0.406: X3.20 23.54,44.45 23.54,41.27 29.26,35.56 29.26,30.03 29.13,29.91 29.13,25.82 29.26,25.69 29.26,17.14 33.38,13.02 33.38,2.86
  Bottom 0.61: DC1.4 51.16,9.84 v51.16,2.85 | v44.81,2.86 33.38,2.86 28.3,2.86 27.99,3.17 27.99,7.46 X1.P$2
AGND  (via drill 0.51)
  Top 0.203: 11.75,33.53 11.96,33.33 C3.2 11.75,33.53 | 11.75,33.53 11.15,34.14 11.15,39.22 11.55,39.62 11.96,39.62 D4.2 12.16,39.83 12.77,39.83 13.18,40.23 13.18,42.06 16.23,45.11 16.23,47.55 C6.2 16.43,47.75 17.04,47.75 18.26,48.97 23.86,48.97 | 11.75,33.53 10.33,32.11 C4.2 10.13,31.9 9.32,31.09 9.32,29.46 U1.15 | 49.75,43.89 49.75,45.92 48.94,46.74 C18.- 48.94,46.94 47.31,48.56 47.31,48.97 | C19.2 57.68,43.89 60.6,43.89 61.04,44.34 61.04,49.23 60.69,49.58 59.1,49.58 | 53,48.36 54.22,49.58 v56.26,49.58 59.1,49.58 | 53,48.36 51.79,47.14 IC2.1 | 59.1,49.58 C15.- | 47.31,48.97 47.31,50.6 47.72,51 50.36,51 53,48.36 | 47.31,48.97 37.99,48.97 | 37.99,48.97 23.86,48.97 | C10.2 18.46,44.7 19.48,44.7 21.64,42.55 X3.19 | v19.68,29.26 17.04,29.26 U1.9 | 33.7,12.8 40.61,12.8 | 40.61,12.8 43.05,12.8 LED3.C | 54.22,3.66 53.61,3.66 51.58,1.63 44.67,1.63 41.22,5.08 | 41.22,5.08 40.61,5.69 40.61,12.8 | 33.7,12.8 29.84,12.8 24.76,7.72 X1.P$1 | 33.7,12.8 33.7,19.51 | 37.99,48.97 v37.99,49.21 | 32.59,30.96 31.8,30.16 31.8,29.53 U2.13 31.8,29.37 31.16,29.37 30.24,28.45 29.7,28.45 29.38,28.77 25.92,28.77 | 32.59,30.96 33.38,30.16 33.38,29.53 U2.16 33.38,29.37 33.7,29.37 U2.17 33.82,27.92 33.9,27.83 33.9,27.84 33.9,27.64 34.11,27.43 34.11,26.42 33.9,26.21 33.9,24.79 | 32.59,30.96 U2.EP 33.09,31.5 33.29,31.7 33.29,33.33 U2.3 | C8.2 33.54,24.45 33.54,21.59 JP1.2 33.7,19.51 | v23.86,49.05 23.86,48.97 | 33.9,24.79 33.7,24.59 C8.2 | 38.58,27.84 38.98,27.43 38.98,20.12 38.37,19.51 33.7,19.51 | 38.58,27.84 37.97,28.45 C7.2 | 38.58,27.84 v42.03,31.29 | 33.9,24.79 C8.2 | v48.53,43.89 49.75,43.89 | 49.75,43.89 C20.2
  Top 0.203: U$5.5 21.83,28.77 25.92,28.77 | v25.92,29.69 25.92,28.77 | LED4.C 41.22,5.08
  Top 0.406: S1.1 54.3,3.73 54.22,3.66
  Top 0.61: C13.2 61.45,22.73 60.69,23.5 DC1.1
  Bottom 0.203: C18.- 48.94,46.74 49.75,45.92 49.75,44.5 C17.2 49.75,44.3 49.35,43.89 v48.53,43.89 | D2.5 38.46,48.42 37.83,49.05 | 37.83,49.05 37.35,49.53 36.56,49.53 35.29,50.8 | 35.29,50.8 34.65,51.44 34.02,51.44 33.38,50.8 D1.5 | D5.5 44.18,48.42 43.07,49.53 41.64,49.53 38.46,52.7 37.19,52.7 35.29,50.8 | v37.99,49.21 37.83,49.05 | v23.86,49.05 23.84,49.07 21.1,46.33 21.1,44.3 22.12,43.28 X3.19 22.32,43.08 22.32,38.41 23.13,37.59 23.22,37.62 25.92,34.92 v25.92,29.69 | v42.03,31.29 40.81,32.51 C11.2 | 56.46,49.58 58.47,49.58 59.1,49.58 C15.- | 56.46,49.58 56.46,47.14 IC1.1 | 56.46,49.58 v56.26,49.58
  Bottom 0.508: C16.2 59.83,44.23 61.32,44.23 61.32,49.21 58.83,49.21 58.47,49.58
  Bottom 0.61: U$5.5 20.95,29.26 v19.68,29.26 | S1.1 54.3,5.26 54.69,5.65 54.69,7 54.3,7.39 54.3,10.88 56.43,13.02 60.05,13.02 61.01,13.97 61.01,17.46 60.05,18.41 | 60.05,18.41 DC1.3 | DC1.1 60.37,23.5 61.01,22.86 61.01,19.37 60.05,18.41
  pour Top (isolate 0.406): 3.22,55.56 3.22,25.72 2.9,25.4 26.4,25.4 26.4,16.51 26.08,16.19 21.32,11.43 21,11.43 21,-0.32 65.45,-0.32 65.45,55.56 3.54,55.56 3.22,55.88
  pour Bottom (isolate 0.406): 3.22,55.24 3.22,25.72 3.54,25.4 26.08,25.4 26.08,16.83 26.4,16.51 21.32,11.43 21.32,0 21.64,-0.32 64.81,-0.32 65.13,0 65.13,54.61 64.81,54.93 3.54,54.93
DD+
  Top 0.203: U1.10 15.62,29.46 15.82,29.67 15.82,31.7 R2.1 16.56,31.75 17.19,32.38 21.64,32.38 21.97,32.05 22.02,32.05 22.58,31.5 22.58,31.45 22.84,31.18 U2.10
DD-
  Top 0.203: R1.1 14.19,31.7 14.19,29.46 U1.11 14.4,29.26 14.4,28.65 15.21,27.84 19.48,27.84 21.31,29.67 21.71,29.67 22.71,30.67 22.75,30.64 31,30.64 U2.11
GND  (via drill 0.51)
  Top 0.203: D3.2 11.35,10.97 11.75,10.97 12.16,11.38 12.16,13.61 10.33,15.44 C9.2 10.33,15.65 11.55,16.87 11.55,17.68 C1.2 11.55,17.88 10.74,18.69 10.13,18.69 9.32,19.51 9.32,20.12 U1.2 9.32,20.32 | 17.04,20.32 U1.8 16.83,20.32 | 21.51,20.93 U$5.2
  Top 0.61: 18.69,20.32 20.9,20.32 21.51,20.93 | 18.69,20.32 17.04,20.32 | 9.32,20.32 9.32,21.57 10.13,22.38 16.02,22.38 16.83,21.57 16.83,20.32 | J1.5 13.71,5.38 v14.02,5.08 | v18.46,12.7 18.46,20.09 18.69,20.32
  Bottom 0.203: 17.24,17.48 C2.2 | 19.27,20.73 C5.2 19.48,20.93 | 21.51,20.93 U$5.2
  Bottom 0.61: 17.24,17.48 17.24,18.69 19.27,20.73 | 21.51,20.93 19.48,20.93 | v14.02,5.08 15.92,5.08 18.46,7.62 v18.46,12.7
GPIO2  (via drill 0.51)
  Top 0.203: v46.4,46.67 R8.1
  Bottom 0.203: X3.10 34.97,45.24 33.7,43.97 33.7,41.59 33.38,41.27 31.48,41.27 31.16,41.59 31.16,48.1 32.43,49.37 32.43,50.32 D1.4 32.59,50.48 32.59,50.96 34.81,53.18 43.7,53.18 45.77,51.12 45.77,48.9 46.4,48.26 v46.4,46.67
GPIO3  (via drill 0.51)
  Top 0.203: v37.51,51.75 33.22,51.75 v31.32,49.85 | R10.1 44.5,41.27 X3.3 | v35.92,33.97 37.51,33.97 37.99,34.45 v38.15,34.45
  Bottom 0.203: v37.51,51.75 37.51,50.48 D2.1 | v31.32,49.85 31.32,48.9 28.62,46.2 28.62,41.27 v35.92,33.97 | v38.15,34.45 38.15,37.1 42.59,40.96 X3.3
GPIO4
  Top 0.203: R11.1 42.44,39.8 42.44,40.7 41.22,41.92 41.22,43.69 41.04,43.87 39.59,43.87 38.78,44.68 38.78,46.04 38.15,46.67 32.75,46.67 32.43,46.2 X3.12
  Bottom 0.203: X3.12 32.43,47.94 D1.3
GPIO5
  Top 0.203: R12.1 40.61,39.8 40.61,42.55 X3.5
  Bottom 0.203: X3.5 38.78,44.45 38.78,46.04 39.26,46.51 39.26,47.94 D2.4
GPIO6
  Top 0.203: R13.1 39.39,40.03 39.39,41.45 38.78,42.06 38.78,43.69 37.56,44.91 X3.8
  Bottom 0.203: X3.8 37.51,47.94 D2.6
GPIO7  (via drill 0.51)
  Top 0.203: v38.3,41.12 R14.1
  Bottom 0.203: 41.32,47.47 42.59,46.2 X3.4 | 41.32,47.47 39.42,49.37 39.42,50.32 D2.3 | v38.3,41.12 40.53,41.12 41.32,41.91 41.32,47.47
GPIO8  (via drill 0.51)
  Top 0.203: v36.08,41.43 34.97,40.32 R15.1 | v35.92,35.24 36.08,35.4 39.42,35.4 39.73,35.72 v39.73,36.04
  Bottom 0.203: D5.4 45.13,47.94 X3.2 46.72,44.29 46.72,41.59 41.16,36.04 v39.73,36.04 | v36.08,41.43 36.08,35.4 v35.92,35.24
GPIO9
  Top 0.203: X3.9 34.97,42.23 33.07,40.32 R16.1
  Bottom 0.203: X3.9 36.24,44.45 36.24,47.47 34.34,49.37 34.34,50.32 D1.6
GPIO10  (via drill 0.51)
  Top 0.203: v42.11,48.1 31.64,48.1 31.16,47.62 31.16,44.13 31.48,43.81 33.38,43.81 33.7,43.5 33.7,42.23 R17.1
  Bottom 0.203: v42.11,48.1 43.23,48.1 D5.6 43.38,47.94 43.38,46.51 43.86,46.04 43.86,43.18 45.19,42.61 X3.1
GPIO11
  Top 0.203: X3.11 31.48,42.55 29.26,40.32 R18.1
  Bottom 0.203: X3.11 32.43,43.34 33.7,44.61 33.7,46.04 34.18,46.51 34.18,47.94 D1.1
N$2
  Top 0.203: L2.2 15.41,12.6 15.41,13.21 14.4,14.22 R7.1
N$3
  Top 0.203: L3.3 14.8,35.56 14.8,34.34 14.19,33.73 R1.2
N$4
  Top 0.203: L3.2 15.82,35.56 15.82,33.73 R2.2
N$5
  Top 0.203: R9.2 16.83,16.26 16.83,18.29 15.62,19.51 15.62,20.12 U1.7
N$6
  Top 0.203: L2.3 16.43,12.6 16.43,13.82 16.83,14.22 R9.1
N$7
  Top 0.203: R7.2 14.4,16.26 14.4,20.12 U1.6
N$8
  Top 0.203: 9.93,13.21 10.13,13.41 C9.1 | 8.3,15.44 L4.1 | 8.3,13.21 L5.2
  Top 0.61: 9.93,13.21 8.3,13.21 8.3,15.44
N$10
  Bottom 0.203: 21.1,16.05 L1.2 | 21.51,18.29 U$5.1
  Bottom 0.61: 21.1,16.05 21.1,17.88 21.51,18.29
N$11  (via drill 0.51)
  Top 0.203: v30.05,29.53 30.68,30.16 31,30.16 U2.12 | v30.05,26.19 30.05,25.08 30.68,24.45 C8.1
  Bottom 0.203: v30.05,26.19 v30.05,29.53
N$14
  Top 0.203: 16.83,40.64 16.83,41.05 18.46,42.67 C10.1 | 16.83,40.64 16.83,39.42 17.65,38.61 17.65,36.17 L6.2 | 16.83,40.64 L7.1
N$15
  Top 0.203: R19.1 LED4.A
N$18
  Top 0.203: LED1.A 44.67,7.72 47.92,7.72 R3.1
N$19
  Top 0.203: R4.1 LED2.A
N$21  (via drill 0.51)
  Top 0.203: v43.86,18.57 43.86,9.55 43.25,8.94 43.25,7.72 LED1.C | U2.18 34.32,27.99 38.15,24.16 v38.15,20.48
  Bottom 0.203: v38.15,20.48 40.05,18.57 v43.86,18.57
N$22  (via drill 0.51)
  Top 0.203: LED2.C 43.05,10.16 43.05,9.35 42.23,8.53 42.23,7.78 v41.48,7.78 | v35.29,28.89 35.13,29.05 35.13,30.16 U2.19
  Bottom 0.203: v35.29,28.89 34.81,28.89 34.65,29.05 32.75,29.05 31,27.3 31,22.54 30.05,21.59 30.05,19.05 34.49,14.61 35.29,14.61 41.48,8.41 v41.48,7.78
N$23  (via drill 0.51)
  Top 0.203: v36.24,29.69 36.24,30.16 35.76,30.64 35.13,30.64 U2.20 | v45.61,36.35 46.56,37.31 46.56,37.62 R8.2
  Bottom 0.203: v36.24,29.69 45.29,29.69 45.61,30 v45.61,36.35
N$24
  Top 0.203: U2.21 40.75,31.18 44.5,34.92 R10.2
N$25
  Top 0.203: LED3.A 44.67,12.8 47.92,12.8 R5.1
N$26
  Top 0.203: U2.22 35.12,31.7 40.56,31.7 42.44,33.58 42.44,37.77 R11.2
N$27
  Top 0.203: R12.2 40.69,33.02 39.85,32.18 U2.23
N$28
  Top 0.203: U2.1 34.34,33.5 34.34,34.92 35.61,36.2 38.46,36.2 38.78,36.51 R13.2
N$29
  Top 0.203: U2.2 33.86,33.5 33.86,35.02 35.67,36.83 36.88,36.83 R14.2
N$30
  Top 0.203: U2.4 32.82,35.31 34.97,37.47 R15.2
N$31
  Top 0.203: U2.5 32.27,33.5 32.27,37.62 32.43,37.78 R16.2
N$32
  Top 0.203: U2.6 31.8,33.5 31.8,37.31 31.32,37.78 R17.2
N$33
  Top 0.203: U2.7 31,32.7 31,33.81 29.26,35.56 R18.2
VBUS1
  Top 0.203: 9.93,17.68 C1.1 | 8.3,17.68 L4.2
  Top 0.61: 9.93,17.68 8.3,17.68 7.67,17.68 7.67,19.85 U1.1
VBUS2  (via drill 0.51)
  Top 0.203: C6.1 19.27,47.55 22.3,47.55 24.76,45.09 X3.18 25.57,45.09 26.94,43.72 28.62,43.72 28.62,41.91 24.71,38 21.91,38 21.51,37.59 21.51,33.73 U$5.7 | C4.1 8.3,31.9 8.3,29.67 8.1,29.46 U1.16 7.89,29.26 v6.88,29.26 | 17.85,33.73 L6.1 | 55.65,43.89 55.65,44.5 C19.1 55.65,43.89 | 56.26,46.94 IC2.3 56.46,46.94 | 59.1,46.94 C15.+ | 49.96,10.16 49.96,7.72 R3.2 | 49.96,10.16 49.96,10.77 50.97,11.79 50.97,12.8 | 50.97,12.8 50.97,13.82 v50.57,14.22 | 49.96,10.16 R4.2 | v27.99,27.78 29.73,27.78 31.16,26.35 32.47,26.35 33.08,26.97 | U2.15 32.82,27.91 33.08,27.64 33.08,26.97 | v36.34,27.23 36.75,26.82 37.76,26.82 C7.1 | v33.09,26.21 33.09,27.03 33.08,26.97 | 50.97,12.8 49.96,12.8 R5.2 | 55.65,43.89 55.61,43.66
  Top 0.254: R6.2 56.88,8.26 57.2,8.57
  Top 0.508: 56.26,46.94 55.65,46.33 55.65,44.5 v53.27,44.5 | 56.46,46.94 59.1,46.94 | 55.61,43.66 55.61,34.61 56.08,34.13 56.08,30.48 JP2.2
  Top 0.61: 21.51,33.73 17.85,33.73 | X1.P$3 31.64,2.38 33.38,0.64 61.01,0.64 61.96,1.59 61.96,7.94 61.32,8.57 57.2,8.57 56.88,8.89 56.88,13.02 55.93,13.97 52.75,13.97 | 52.75,13.97 50.82,13.97 v50.57,14.22 | DC1.2 54.02,20.95 52.75,19.68 52.75,13.97
  Bottom 0.203: 51.79,44.5 C17.1 51.99,44.5 | 51.79,46.94 IC1.3 | 27.99,27.81 v27.99,27.78 27.92,27.78 | v36.34,27.23 34.11,27.23 v33.09,26.21 | 50.57,14.43 50.53,14.61
  Bottom 0.508: 51.79,44.5 51.79,46.94 51.8,46.95 51.8,49.53 49.17,49.53 C14.+ | v53.27,44.5 51.99,44.5
  Bottom 0.61: v6.88,29.26 18.46,29.26 18.66,29.46 18.66,32.91 19.41,33.66 U$5.7 24.18,33.66 24.81,33.02 24.81,28.57 25.14,28.25 27.55,28.25 27.99,27.81 | 50.57,14.43 v50.57,14.22 | 27.92,27.78 27.92,13.86 28.76,13.02 30.84,13.02 31.64,12.22 X1.P$3 | JP2.2 54.66,18.73 50.53,14.61
VBUS_IN  (via drill 0.51)
  Top 0.203: v14.6,12.8 14.6,12.6 13.79,11.79 D3.5
  Top 0.61: J1.1 10.36,7.59 v10.36,5.03 | v7.03,10.79 8.3,10.79 L5.1
  Bottom 0.203: 19.07,17.68 19.27,17.88 C5.1 | 19.07,16.05 L1.1 18.87,15.85
  Bottom 0.61: 19.07,17.68 19.07,16.05 | 18.87,15.85 15.82,12.8 v14.6,12.8 7.61,12.8 7.03,12.22 v7.03,10.79 7.03,5.71 7.72,5.03 v10.36,5.03
VD2  (via drill 0.51)
  Top 0.203: v17.85,39.62 18.87,40.64 L7.2 | v15.62,39.62 14.8,40.44 D4.5 | v22.32,37.19 24.53,37.19 X3.13
  Bottom 0.203: v15.62,39.62 v17.85,39.62 19.88,39.62 v22.32,37.19
VDD  (via drill 0.51)
  Top 0.203: v36.95,33.12 36.55,32.72 35.12,32.72 U2.24 | v51.79,11.99 51.79,7.52 49.96,5.69 49.96,5.08 R19.2
  Top 0.61: v43.66,32.92 49.47,32.92 JP2.5 JP2.3 JP2.1
  Bottom 0.203: 38.78,32.72 C11.1 | 48.59,12.67 48.64,12.62 51.15,12.62 v51.79,11.99
  Bottom 0.406: X3.7 37.19,42.55 37.19,33.36 v36.95,33.12 37.36,32.72 38.78,32.72 | v43.66,32.92 42.29,34.29 40.24,34.29 38.78,32.83 C11.1 | JP2.1 JP2.5 50.84,31.75 50.84,17.14 48.43,14.73 48.43,12.83 48.59,12.67
VDD1  (via drill 0.51)
  Top 0.203: U1.3 10.54,20.32 11.75,20.32 U1.4 11.96,20.32 12.97,20.32 U1.5 13.18,20.12 13.58,19.71 v13.58,18.29
  Bottom 0.203: 15.21,17.48 C2.1
  Bottom 0.61: 15.21,17.48 14.4,17.48 v13.58,18.29
VDD2
  Top 0.203: 11.96,29.46 11.96,31.29 C3.1 | U1.14 10.54,29.46 11.75,29.46 U1.13 11.96,29.46 | 11.96,29.46 12.97,29.46 U1.12

### Text on the board
Top: AllSerial-Master